# EAGLE design Flight Controller Auxiliary Board (EAGLE 8.6.0)
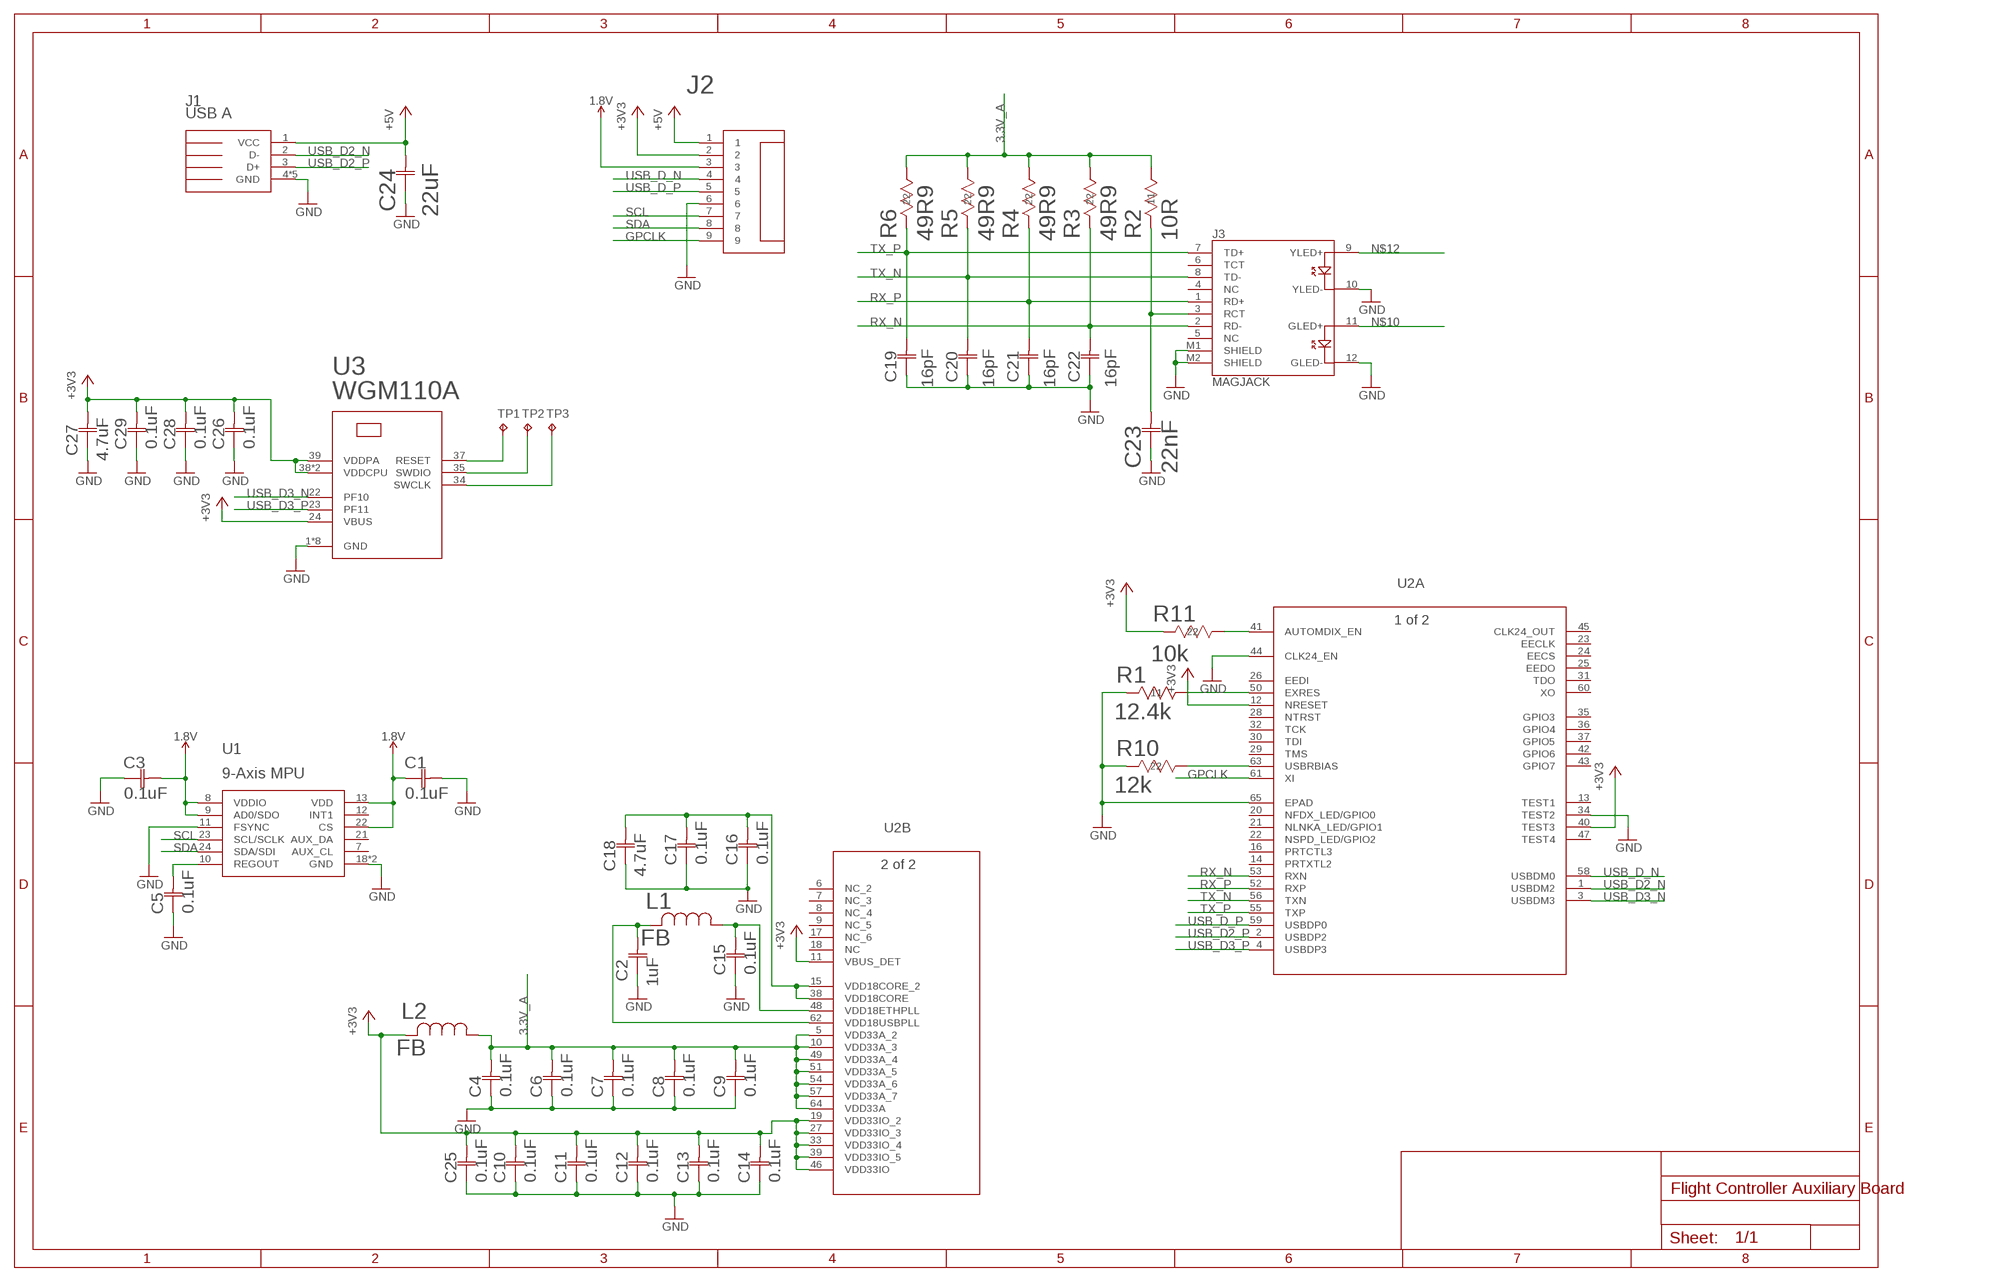
[diagram p0: schematic, sheet 1]

## Parts
C1  0.1uF  0402ZD104KAT2A0402-M  [0402-M]
C2  1uF  CC0805KKX7R7BB105  [YAG_CC0805]
C3  0.1uF  0402ZD104KAT2A0402-M  [0402-M]
C4  0.1uF  0402ZD104KAT2A0402-M  [0402-M]
C5  0.1uF  0402ZD104KAT2A0402-M  [0402-M]
C6  0.1uF  0402ZD104KAT2A0402-M  [0402-M]
C7  0.1uF  0402ZD104KAT2A0402-M  [0402-M]
C8  0.1uF  0402ZD104KAT2A0402-M  [0402-M]
C9  0.1uF  0402ZD104KAT2A0402-M  [0402-M]
C10  0.1uF  0402ZD104KAT2A0402-M  [0402-M]
C11  0.1uF  0402ZD104KAT2A0402-M  [0402-M]
C12  0.1uF  0402ZD104KAT2A0402-M  [0402-M]
C13  0.1uF  0402ZD104KAT2A0402-M  [0402-M]
C14  0.1uF  0402ZD104KAT2A0402-M  [0402-M]
C15  0.1uF  0402ZD104KAT2A0402-M  [0402-M]
C16  0.1uF  0402ZD104KAT2A0402-M  [0402-M]
C17  0.1uF  0402ZD104KAT2A0402-M  [0402-M]
C18  4.7uF  06036D475KAT2A0603-M  [0603-M]
C19  16pF  GRM1555C1H160JA01DG-155-M  [G-155-M]
C20  16pF  GRM1555C1H160JA01DG-155-M  [G-155-M]
C21  16pF  GRM1555C1H160JA01DG-155-M  [G-155-M]
C22  16pF  GRM1555C1H160JA01DG-155-M  [G-155-M]
C23  22nF  GRM155R71H223KA12DG-155-M  [G-155-M]
C24  22uF  GRM21BR60J226ME39L  [G-21]
C25  0.1uF  0402ZD104KAT2A0402-M  [0402-M]
C26  0.1uF  0402ZD104KAT2A0402-M  [0402-M]
C27  4.7uF  06036D475KAT2A0603-M  [0603-M]
C28  0.1uF  0402ZD104KAT2A0402-M  [0402-M]
C29  0.1uF  0402ZD104KAT2A0402-M  [0402-M]
J1  USB_A_VERT  [USB_A_VERTICAL]
J2  9POS_FFC_CONNECTOR  [9POS_FFC_CONNECTOR]
J3  MAGJACK  [MAGJACK]
L1  FB  BLM18AG601SN1DIND_BLM18_0603-M  [IND_BLM18_0603-M]
L2  FB  BLM18AG601SN1DIND_BLM18_0603-M  [IND_BLM18_0603-M]
R1  12.4k  RC0402FR-0712K4LYAG_R0402-M  [YAG_R0402-M]
R2  10R  RNCP0805FTD10R0STA_RNCP0805-M  [STA_RNCP0805-M]
R3  49R9  RC0402FR-0749K9LRC0402N-M  [RC0402N-M]
R4  49R9  RC0402FR-0749K9LRC0402N-M  [RC0402N-M]
R5  49R9  RC0402FR-0749K9LRC0402N-M  [RC0402N-M]
R6  49R9  RC0402FR-0749K9LRC0402N-M  [RC0402N-M]
R10  12k  RC0402FR-0712KLRC0402N-M  [RC0402N-M]
R11  10k  ERA-6AEB103V  [RC0805N]
TP1  TPB2,54  [B2,54]
TP2  TPB2,54  [B2,54]
TP3  TPB2,54  [B2,54]
U1  ICM-20948  [QFN40P300X300X105-25N]
U2  LAN9512-JZXQFN64_9X9MC-M  [QFN64_9X9MC-M]
U3  WGM110A  [WGM110A]

## Nets
1.8V: C1.1 C3.2 J2.3 U1.8(VDDIO) U1.9(AD0/SDO) U1.13(VDD) U1.22(CS)
3.3V_A: C4.2 C6.2 C7.2 C8.2 C9.2 L2.1 R2.2 R3.1 R4.1 R5.1 R6.1 U2.5(B:VDD33A_2) U2.10(B:VDD33A_3) U2.49(B:VDD33A_4) U2.51(B:VDD33A_5) U2.54(B:VDD33A_6) U2.57(B:VDD33A_7) U2.64(B:VDD33A)
+3V3: C10.2 C11.2 C12.2 C13.2 C14.2 C25.2 C26.2 C27.2 C28.2 C29.2 J2.2 L2.2 R11.2 U2.11(B:VBUS_DET) U2.12(A:NRESET) U2.19(B:VDD33IO_2) U2.27(B:VDD33IO_3) U2.33(B:VDD33IO_4) U2.39(B:VDD33IO_5) U2.40(A:TEST3) U2.46(B:VDD33IO) U3.24(VBUS) U3.38(VDDCPU) U3.39(VDDPA) U3.51(VDDCPU)
+5V: C24.2 J1.1(VCC) J2.1
GND: C1.2 C2.1 C3.1 C4.1 C5.1 C6.1 C7.1 C8.1 C9.1 C10.1 C11.1 C12.1 C13.1 C14.1 C15.1 C16.1 C17.1 C18.1 C19.1 C20.1 C21.1 C22.1 C23.1 C24.1 C25.1 C26.1 C27.1 C28.1 C29.1 J1.4(GND) J1.P$5(GND) J1.P$6(GND) J1.P$7(GND) J1.P$8(GND) J2.6 J3.10(YLED-) J3.12(GLED-) J3.M1(SHIELD) J3.M2(SHIELD) R1.1 R10.2 U1.11(FSYNC) U1.18(GND) U1.20(GND) U2.34(A:TEST2) U2.44(A:CLK24_EN) U2.65(A:EPAD) U3.1(GND) U3.16(GND) U3.25(GND) U3.40(GND) U3.42(GND) U3.44(GND) U3.46(GND) U3.48(GND)
GPCLK: J2.9 U2.61(A:XI)
N$1: R11.1 U2.41(A:AUTOMDIX_EN)
N$2: R10.1 U2.63(A:USBRBIAS)
N$3: C15.2 L1.1 U2.48(B:VDD18ETHPLL)
N$4: C2.2 L1.2 U2.62(B:VDD18USBPLL)
N$7: TP1.TP U3.37(RESET)
N$8: TP2.TP U3.35(SWDIO)
N$9: TP3.TP U3.34(SWCLK)
N$10: J3.11(GLED+)
N$11: C5.2 U1.10(REGOUT)
N$12: J3.9(YLED+)
N$14: R1.2 U2.50(A:EXRES)
N$15: C16.2 C17.2 C18.2 U2.15(B:VDD18CORE_2) U2.38(B:VDD18CORE)
N$16: C23.2 J3.3(RCT) R2.1
RX_N: C22.2 J3.2(RD-) R3.2 U2.53(A:RXN)
RX_P: C21.2 J3.1(RD+) R4.2 U2.52(A:RXP)
SCL: J2.7 U1.23(SCL/SCLK)
SDA: J2.8 U1.24(SDA/SDI)
TX_N: C20.2 J3.8(TD-) R5.2 U2.56(A:TXN)
TX_P: C19.2 J3.7(TD+) R6.2 U2.55(A:TXP)
USB_D2_N: J1.2(D-) U2.1(A:USBDM2)
USB_D2_P: J1.3(D+) U2.2(A:USBDP2)
USB_D3_N: U2.3(A:USBDM3) U3.22(PF10)
USB_D3_P: U2.4(A:USBDP3) U3.23(PF11)
USB_D_N: J2.4 U2.58(A:USBDM0)
USB_D_P: J2.5 U2.59(A:USBDP0)
Unconnected: J3.4(NC) J3.5(NC) J3.6(TCT) U1.7(AUX_CL) U1.12(INT1) U1.21(AUX_DA) U2.6(B:NC_2) U2.7(B:NC_3) U2.8(B:NC_4) U2.9(B:NC_5) U2.13(A:TEST1) U2.14(A:PRTXTL2) U2.16(A:PRTCTL3) U2.17(B:NC_6) U2.18(B:NC) U2.20(A:NFDX_LED/GPIO0) U2.21(A:NLNKA_LED/GPIO1) U2.22(A:NSPD_LED/GPIO2) U2.23(A:EECLK) U2.24(A:EECS) U2.25(A:EEDO) U2.26(A:EEDI) U2.28(A:NTRST) U2.29(A:TMS) U2.30(A:TDI) U2.31(A:TDO) U2.32(A:TCK) U2.35(A:GPIO3) U2.36(A:GPIO4) U2.37(A:GPIO5) U2.42(A:GPIO6) U2.43(A:GPIO7) U2.45(A:CLK24_OUT) U2.47(A:TEST4) U2.60(A:XO)

## Library data of the parts
C1 C3-C17 C25 C26 C28 C29 = 0.1uF-capacitor-0402:0402ZD104KAT2A; MANUFACTURER_PART_NUMBER: 0402ZD104KAT2A; VENDOR: AVX Corporation
C2 = 1uF X7R Ceramic Capacitor:CC0805KKX7R7BB105; COPYRIGHT: Copyright C 2015 Accelerated Designs. All rights reserved; MANUFACTURER_PART_NUMBER: CC0805KKX7R7BB105; VENDOR: Vendor
C18 C27 = 4.7uF-capacitor:06036D475KAT2A; MANUFACTURER_PART_NUMBER: 06036D475KAT2A; VENDOR: AVX Corporation
C19-C22 = 16pF-capacitor:GRM1555C1H160JA01D; MANUFACTURER_PART_NUMBER: GRM1555C1H160JA01D; VENDOR: Murata
C23 = 22nF-capacitor:GRM155R71H223KA12D; MANUFACTURER_PART_NUMBER: GRM155R71H223KA12D; VENDOR: Murata
C24 = 22uF X5R Ceramic Capacitor:GRM21BR60J226ME39L; COPYRIGHT: Copyright C 2015 Accelerated Designs. All rights reserved; MANUFACTURER_PART_NUMBER: GRM21BR60J226ME39L; VENDOR: Vendor
J1 = thanics_robotics:USB_A_VERT
J2 = thanics_robotics:9POS_FFC_CONNECTOR
J3 = SparkFun-Connectors:MAGJACK: MAGJACK: RJ-45 with LEDs This is a single port, RJ45 ethernet jacks with built in transformer (magnetics), status LEDs, and shielding. Here is the connector we sell at SparkFun: RJ45 Ethernet MagJack-Compatible <https://www.sparkfun.com/products/8534> (PRT-08534) Datasheet <http://www.sparkfun.com/datasheets/Prototyping/MagJack.pdf> It is used on this SparkFun product: SparkFun RJ45 MagJack Breakout <https://www.sparkfun.com/products/13021> (BOB-13021); PROD_ID: CONN-09556; SF_ID: PRT-08534
L1 L2 = 600ohm-fb:BLM18AG601SN1D; MANUFACTURER_PART_NUMBER: BLM18AG601SN1D; VENDOR: MURATA
R1 = 12.4k-resistor:RC0402FR-0712K4L; MANUFACTURER_PART_NUMBER: RC0402FR0712K4L; VENDOR: Yageo
R2 = 10-resistor:RNCP0805FTD10R0; COPYRIGHT: Copyright C 2015 Accelerated Designs. All rights reserved; MANUFACTURER_PART_NUMBER: RNCP0805FTD10R0; VENDOR: Vendor
R3-R6 = 49.9-resistor:RC0402FR-0749K9L; MANUFACTURER_PART_NUMBER: RC0402FR0749K9L; VENDOR: Yageo
R10 = 12k-resistor:RC0402FR-0712KL; MANUFACTURER_PART_NUMBER: RC0402FR0712KL; VENDOR: Yageo
R11 = 10k-resistor:ERA-6AEB103V; CASE: 0805 2012 metric; COMPOSITION: Thin Film; COPYRIGHT: Copyright C 2015 Accelerated Designs. All rights reserved; DATASHEET: httpindustrial.panasonic.comwwwcgijvcr13pz.cgi?E+PZ+3+AOA0026+ERA6AEB103V+7+WW; DIGIKEYPARTNUMBER: P10KDATRND; HEIGHT: 0.024" 0.60mm; LEADSTYLE: Surface Mount SMD SMT; MANUFACTURER_PART_NUMBER: ERA6AEB103V; NUMBEROFTERMINATIONS: 2; PACKAGECASE: 0805 2012 Metric; PACKAGING: Tape &amp Reel TR; POWERWATTS: 0.125W 18W; QUANTITY_AVAILABLE: 225000; RESISTANCEINOHMS: 10.0K; RESISTANCEOHMS: 10K; SIZEDIMENSION: 0.079" L x 0.049" W 2.00mm x 1.25mm; TEMPERATURECOEFFICIENT: 25ppm°C; TOLERANCE: 0.1%; VENDOR: Panasonic; VOLTAGEWORKING: 100V
TP1-TP3 = testpad:TP: Test pad
U1 = ICM-20948-mpu:ICM-20948
U2 = lan9512:LAN9512-JZX; MANUFACTURER_PART_NUMBER: LAN9512JZX; VENDOR: MICROCHIP
U3 = thanics_robotics:WGM110A

## Board
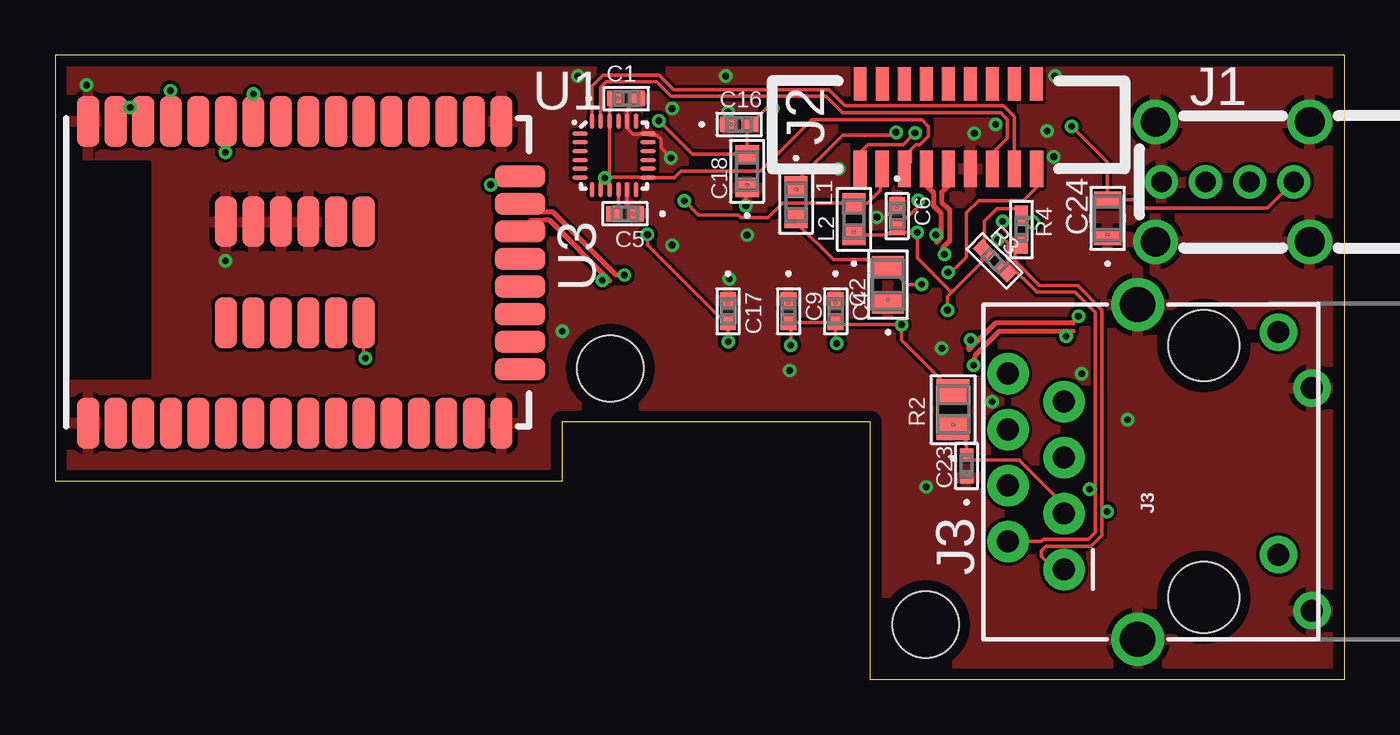
[diagram p1: board, top side]
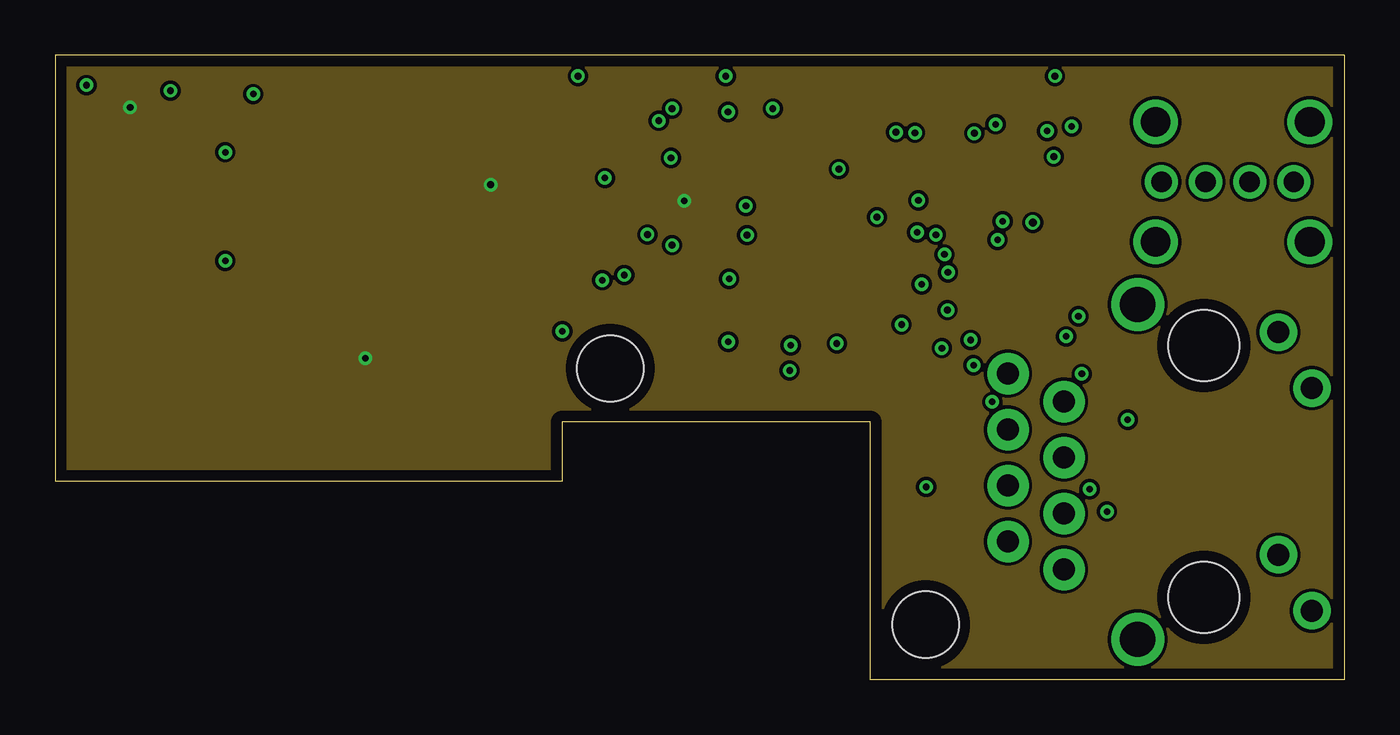
[diagram p2: board, inner layer Route2]
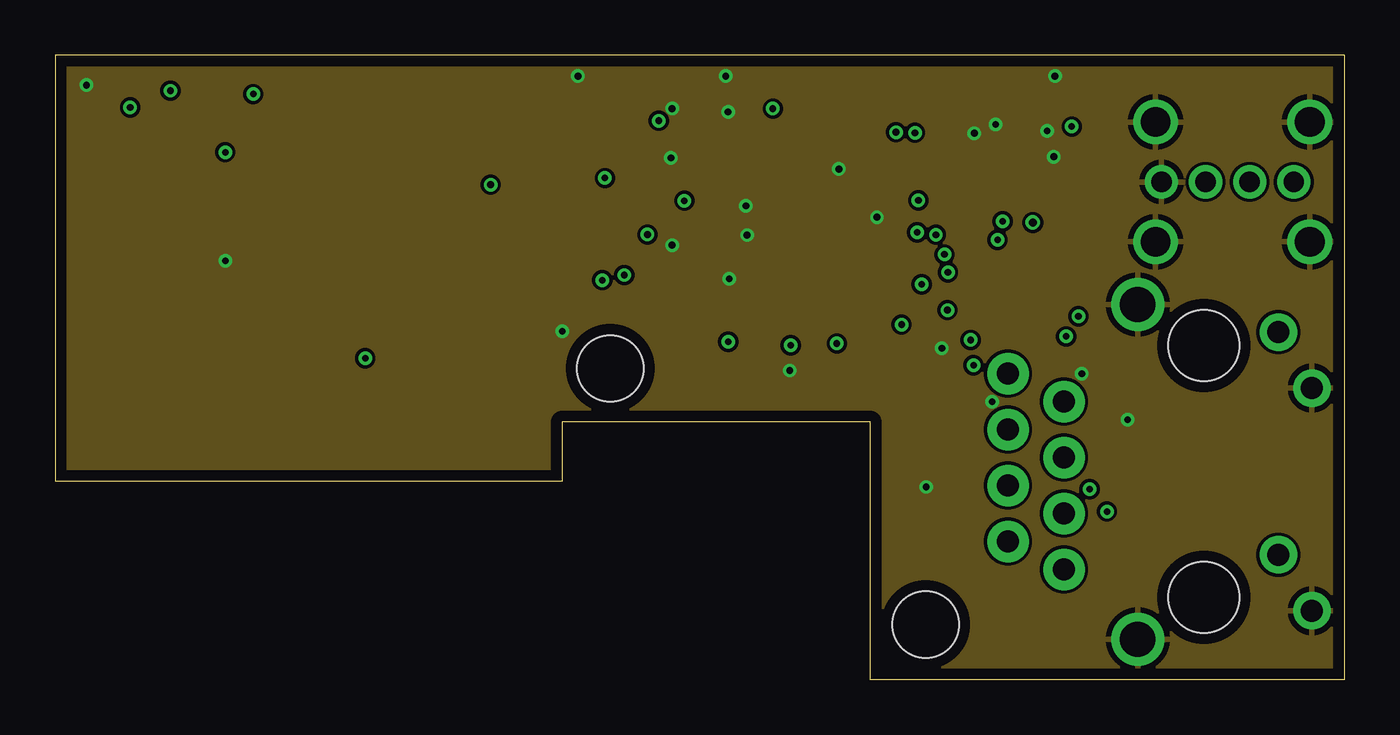
[diagram p3: board, inner layer Route15]
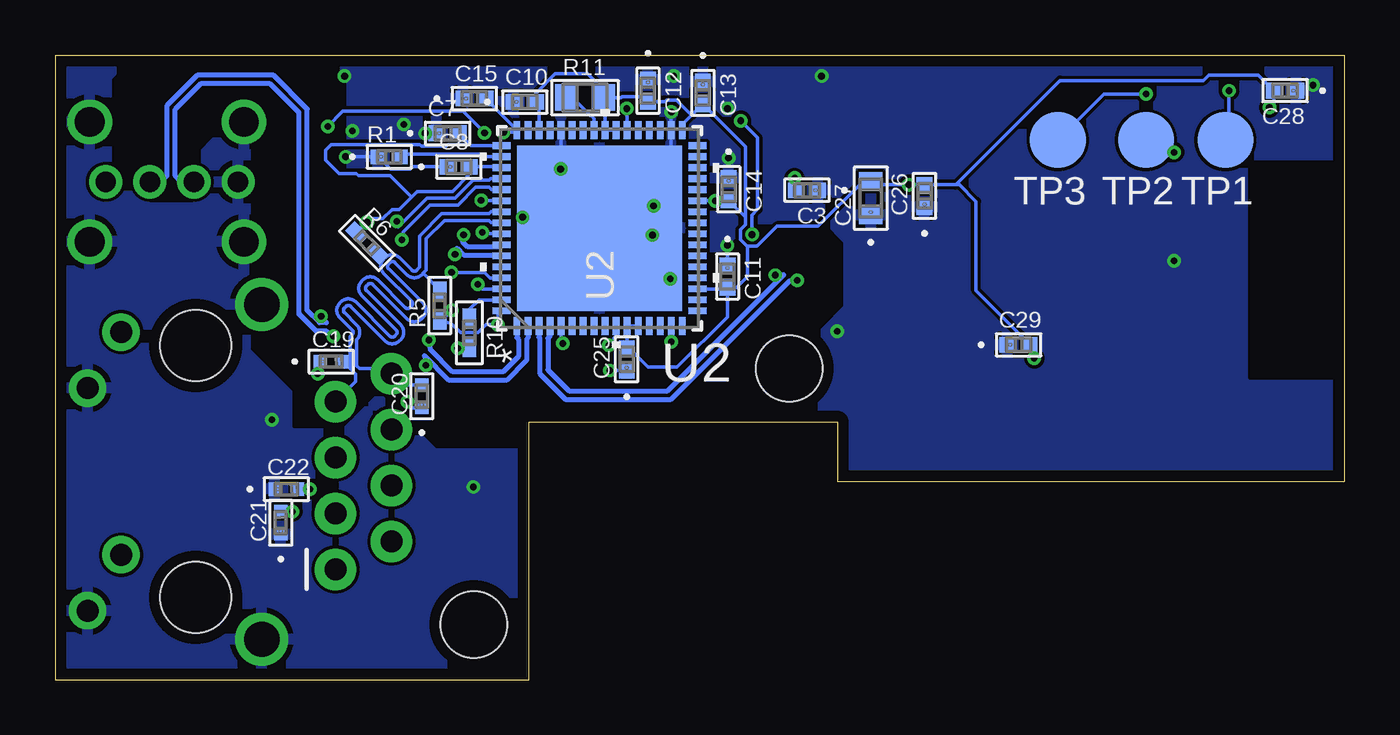
[diagram p4: board, bottom side, seen from below]

Size 58.5 x 28.36 mm. Coordinates in mm from the lower left corner, seen from the top.
Outline: 58.5,28.36 58.5,0 37,0 37,11.7 23,11.7 23,9 0,9 0,28.36 58.5,28.36
Copper layers (1*2*15*16): Top 0.035mm / dielectric 0.2mm / Route2 0.0175mm / dielectric 1.2mm / Route15 0.0175mm / dielectric 0.2mm / Bottom 0.035mm
Design rules "Elecrow_4-layer_PCB_eagle_rule *": minimum track width 6mil, minimum drill 12mil, track to track 6mil, track to pad 6mil, pad to pad 6mil, via to via 8mil, smd to smd 0mil, copper to edge 20mil, drill to drill 10mil, minimum pad ring 6mil, minimum via ring 6mil, stop-mask expansion 0mil, vias tented up to drill 100mil, thermal gap 10mil
Holes 3 mm at 39.5,2.5 25.2,14.13
tRestrict: area -0.1,13.7 to 4.3,23.5
bRestrict: area -0.1,13.7 to 4.3,23.5

### Footprints (pad centres in the part's own frame; a part is rotated, then mirrored left to right if it is on the bottom)
0402-M = smd 0.711 x 0.711: 1 -0.508,0; 2 0.508,0
YAG_CC0805 = smd 0.965 x 1.448: 1 -0.826,0; 2 0.826,0
0603-M = smd 0.813 x 1.067: 1 -0.775,0; 2 0.775,0
G-155-M = smd 0.559 x 0.61: 1 -0.521,0; 2 0.521,0
G-21 = smd 0.711 x 1.245: 1 -0.851,0; 2 0.851,0
USB_A_VERTICAL = drill 0.92 pad 1.5: 1 -3,0; 2 -1,0; 3 1,0; 4 3,0 | drill 1.35 pad 2: P$5 -3.73,-2.72; P$6 -3.73,2.72; P$7 3.27,2.72; P$8 3.27,-2.72
9POS_FFC_CONNECTOR = smd 0.6 x 1.65: 1 -7.27,-2; 2 -6.27,-2; 3 -5.27,-2; 4 -4.27,-2; 5 -3.27,-2; 6 -2.27,-2; 7 -1.27,-2; 8 -0.27,-2; 9 0.73,-2 | smd 0.584 x 1.524: P$16 -7.27,1.852; P$17 -6.27,1.852; P$18 -5.27,1.852; P$19 -4.27,1.852; P$20 -3.27,1.852; P$21 -2.27,1.852; P$22 -1.27,1.852; P$23 -0.27,1.852; P$24 0.73,1.852
MAGJACK = drill 1 pad 1.88: 1 -4.445,6.015; 2 -3.175,8.555; 3 -1.905,6.015; 4 -0.635,8.555; 5 0.635,6.015; 6 1.905,8.555; 7 3.175,6.015; 8 4.445,8.555 | drill 1 pad 1.7: 9 -3.785,-3.715; 10 -6.325,-5.235; 11 6.325,-3.715; 12 3.785,-5.235 | drill 1.6 pad 2.184: M1 -7.62,2.67; M2 7.58,2.67 | hole 3.2: -5.715,-0.335; 5.715,-0.335
IND_BLM18_0603-M = smd 0.914 x 1.041: 1 -0.724,0; 2 0.724,0
YAG_R0402-M = smd 0.66 x 0.66: 1 -0.508,0; 2 0.508,0
STA_RNCP0805-M = smd 1.118 x 1.499: 1 -0.826,0; 2 0.826,0
RC0402N-M = smd 0.864 x 0.61: 1 -0.66,0; 2 0.66,0
RC0805N = smd 1.006 x 1.2: 1 -0.853,0; 2 0.853,0
B2,54 = smd 2.54 x 2.54: TP 0,0
QFN40P300X300X105-25N = smd 0.7 x 0.2: 1 -1.55,1; 2 -1.55,0.6; 3 -1.55,0.2; 4 -1.55,-0.2; 5 -1.55,-0.6; 6 -1.55,-1; 13 1.55,-1; 14 1.55,-0.6; 15 1.55,-0.2; 16 1.55,0.2; 17 1.55,0.6; 18 1.55,1 | smd 0.2 x 0.7: 7 -1,-1.55; 8 -0.6,-1.55; 9 -0.2,-1.55; 10 0.2,-1.55; 11 0.6,-1.55; 12 1,-1.55; 19 1,1.55; 20 0.6,1.55; 21 0.2,1.55; 22 -0.2,1.55; 23 -0.6,1.55; 24 -1,1.55
QFN64_9X9MC-M = smd 0.813 x 0.305: 1 -4.445,3.75; 2 -4.445,3.25; 3 -4.445,2.75; 4 -4.445,2.25; 5 -4.445,1.75; 6 -4.445,1.25; 7 -4.445,0.75; 8 -4.445,0.25; 9 -4.445,-0.25; 10 -4.445,-0.75; 11 -4.445,-1.25; 12 -4.445,-1.75; 13 -4.445,-2.25; 14 -4.445,-2.75; 15 -4.445,-3.25; 16 -4.445,-3.75; 33 4.445,-3.75; 34 4.445,-3.25; 35 4.445,-2.75; 36 4.445,-2.25; 37 4.445,-1.75; 38 4.445,-1.25; 39 4.445,-0.75; 40 4.445,-0.25; 41 4.445,0.25; 42 4.445,0.75; 43 4.445,1.25; 44 4.445,1.75; 45 4.445,2.25; 46 4.445,2.75; 47 4.445,3.25; 48 4.445,3.75 | smd 0.305 x 0.813: 17 -3.75,-4.445; 18 -3.25,-4.445; 19 -2.75,-4.445; 20 -2.25,-4.445; 21 -1.75,-4.445; 22 -1.25,-4.445; 23 -0.75,-4.445; 24 -0.25,-4.445; 25 0.25,-4.445; 26 0.75,-4.445; 27 1.25,-4.445; 28 1.75,-4.445; 29 2.25,-4.445; 30 2.75,-4.445; 31 3.25,-4.445; 32 3.75,-4.445; 49 3.75,4.445; 50 3.25,4.445; 51 2.75,4.445; 52 2.25,4.445; 53 1.75,4.445; 54 1.25,4.445; 55 0.75,4.445; 56 0.25,4.445; 57 -0.25,4.445; 58 -0.75,4.445; 59 -1.25,4.445; 60 -1.75,4.445; 61 -2.25,4.445; 62 -2.75,4.445; 63 -3.25,4.445; 64 -3.75,4.445 | smd 7.493 x 7.493: 65 0,0
WGM110A = smd 2.3 x 1: 1 -6.85,0; 2 -6.85,-1.25; 3 -6.85,-2.5; 4 -6.85,-3.75; 5 -6.85,-5; 6 -6.85,-6.25; 7 -6.85,-7.5; 8 -6.85,-8.75; 9 -6.85,-10; 10 -6.85,-11.25; 11 -6.85,-12.5; 12 -6.85,-13.75; 13 -6.85,-15; 14 -6.85,-16.25; 15 -6.85,-17.5; 16 -6.85,-18.75; 25 6.85,-18.75; 26 6.85,-17.5; 27 6.85,-16.25; 28 6.85,-15; 29 6.85,-13.75; 30 6.85,-12.5; 31 6.85,-11.25; 32 6.85,-10; 33 6.85,-8.75; 34 6.85,-7.5; 35 6.85,-6.25; 36 6.85,-5; 37 6.85,-3.75; 38 6.85,-2.5; 39 6.85,-1.25; 40 6.85,0; 41 -2.3,-6.25; 42 2.3,-6.25; 43 -2.3,-7.5; 44 2.3,-7.5; 45 -2.3,-8.75; 46 2.3,-8.75; 47 -2.3,-10; 48 2.3,-10; 49 -2.3,-11.25; 50 2.3,-11.25; 51 -2.3,-12.5; 52 2.3,-12.5 | smd 1 x 2.3: 17 -4.4,-19.6; 18 -3.15,-19.6; 19 -1.9,-19.6; 20 -0.65,-19.6; 21 0.6,-19.6; 22 1.85,-19.6; 23 3.1,-19.6; 24 4.35,-19.6

### Placement (x,y rotation side)
C1  25.91,26.38 0 top
C2  37.79,17.93 90 top
C3  24.39,22.22 180 bottom
C4  35.41,16.73 270 top
C5  25.86,21.15 180 top
C6  38.2,21.05 270 top
C7  40.69,24.81 0 bottom
C8  40.19,23.28 0 bottom
C9  33.28,16.73 270 top
C10  37.19,26.23 0 bottom
C11  27.99,18.31 270 bottom
C12  31.6,26.74 270 bottom
C13  29.11,26.64 270 bottom
C14  27.94,22.27 270 bottom
C15  39.47,26.38 0 bottom
C16  31.04,25.21 0 top
C17  30.53,16.73 270 top
C18  31.4,23.08 90 top
C19  45.98,14.44 0 bottom
C20  41.86,12.87 90 bottom
C21  48.26,7.13 90 bottom
C22  48.01,8.65 0 bottom
C23  41.35,9.71 90 top
C24  47.75,20.95 90 top
C25  32.57,14.55 90 bottom
C26  19.05,21.96 90 bottom
C27  21.49,21.86 90 bottom
C28  2.69,26.74 180 bottom
C29  14.79,15.21 0 bottom
J1  53.2,22.6 180 top
J2  43.8,25.19 0 top
J3  51.79,9.46 90 top
L1  33.62,21.67 270 top
L2  36.25,20.9 90 top
R1  43.33,23.74 0 bottom
R2  40.74,12.26 90 top
R3  42.62,19.02 315 top
R4  43.84,20.44 270 top
R5  41.05,16.98 90 bottom
R6  44.35,19.83 315 bottom
R10  39.71,15.75 270 bottom
R11  34.45,26.42 0 bottom
TP1  5.4,24.5 180 bottom
TP2  9,24.5 180 bottom
TP3  13,24.5 180 bottom
U1  25.36,23.8 0 top
U2  33.79,20.49 90 bottom
U3  1.5,18.5 90 top

### Tracks (layer width: path | path; a pad name or v marks a point on that pad's centre or on a via)
1.8V  (via drill 0.3)
  Top 0.152: v24.95,22.78 24.76,22.59 U1.8 | U1.9 25.16,22.56 v24.95,22.78 | 25.15,22.83 26.49,22.83 26.52,22.8 U1.13 28.12,22.8 28.4,23.08 32.01,23.08 34.34,25.42 39.32,25.42 39.63,25.11 39.63,24.68 39.24,24.3 39.06,24.3 38.81,24.05 38.81,23.47 J2.3 | 25.15,22.83 24.99,22.83 v24.95,22.78 | C1.1 25.4,26.18 25.15,25.93 25.15,25.36 U1.22 25.16,22.84 25.15,22.83
  Bottom 0.152: C3.2 24.95,22.27 v24.95,22.78
3.3V_A  (via drill 0.3, 0.35)
  Top 0.152: C6.2 38.2,20.64 37.74,20.18 L2.1 | C6.2 38.48,20.31 v39.12,20.31 39.12,19.13 40.61,17.65 40.74,17.65 | C4.2 35.51,16.12 v38.41,16.12 38.41,15.42 R2.2 | C4.2 C9.2 33.38,16.12 v33.38,15.19 | C6.2 38.64,20.97 38.65,20.97 39.17,21.49 v39.17,21.76 | v40.49,16.78 40.49,17.39 40.74,17.65 | 40.74,17.65 42.06,18.96 42.06,19.48 R3.1 42.16,20.81 42.73,21.38 43.56,21.38 R4.1 44.02,21.1 v44.36,20.75 | C4.2 35.41,15.33 v35.47,15.27
  Bottom 0.152: U2.51 38.28,23.28 C8.2 39.75,23.21 39.75,22.89 40.47,22.17 42.07,22.17 42.33,21.91 | U2.54 39.15,21.74 v39.17,21.76 | U2.57 39.05,20.24 v39.12,20.31 | U2.64 38.41,16.58 v38.41,16.12 38.94,16.12 39.31,15.76 40.1,15.76 40.52,16.17 R5.1 40.95,16.32 v40.49,16.78 | 42.33,21.91 42.89,21.34 43.22,21.34 43.63,20.93 44.19,20.93 v44.36,20.75 R6.1 | v33.38,15.19 33.15,15.41 33.15,15.51 33.05,15.61 U2.10 | U2.49 39.62,24.24 39.68,24.3 | 39.68,24.3 C7.2 | 39.68,24.3 40.67,24.3 40.75,24.22 41.88,24.22 41.96,24.3 45.98,24.3 46.23,24.05 46.23,23.59 45.62,22.98 44.83,22.98 44.73,22.88 43.3,22.88 42.33,21.91 | U2.5 35.55,15.34 v35.47,15.27
+3V3  (via drill 0.3)
  Top 0.152: J2.2 37.44,23.1 37.44,22.22 36.85,21.63 L2.2 34.24,21.63 34.23,21.63 33.01,21.63 32.34,20.97 31.12,20.97 31.01,21.09 29.2,21.09 v28.55,21.74 | U3.24 20.72,22.47 v19.76,22.47 | U3.51 14,14.67 v14.07,14.6 | U3.39 3.38,25.98 v3.41,25.98 3.41,25.94 U3.38
  Bottom 0.152: U2.19 28.05,17.74 C11.2 | U2.33 30.05,25.2 29.59,25.65 | 29.59,25.65 C13.2 27.18,24.2 27.18,21 | U2.39 U2.40 33.55,26.37 R11.2 33.53,26.42 | 29.59,25.65 29.65,25.65 30.31,26.31 30.75,26.31 30.83,26.23 C12.2 31.83,26.46 32.79,26.46 32.82,26.42 33.53,26.42 | U2.27 v28.55,21.74 27.96,21.74 C14.2 27.18,21 | C11.2 27.59,17.8 27.08,18.31 27.08,19.68 | C11.2 27.99,16.48 30.28,14.19 31.59,14.19 32.56,15.16 C25.2 32.51,16.02 U2.11 U2.12 | U2.46 36.55,26.09 C10.2 36.68,26.64 35.82,27.5 34.34,27.5 33.78,26.94 33.78,26.68 33.53,26.42 | v14.07,14.6 14.07,15 C29.2 14.71,15.64 14.71,15.66 16.72,17.66 16.72,21.71 17.48,22.47 17.63,22.47 | v3.41,25.98 3.2,26.18 C28.2 3.91,27.45 6.15,27.45 6.4,27.2 12.91,27.2 17.63,22.47 | 17.63,22.47 C26.2 v19.76,22.47 21.33,22.47 C27.2 21.83,22.64 23.88,20.59 25.74,20.59 26.66,19.68 27.08,19.68 | 27.18,21 27.18,20.66 27.41,20.43 27.41,19.99 27.1,19.68 27.08,19.68
  pour Route2: 0.05,28.26 58.57,28.26 58.57,0.07 0.05,0.07
+5V  (via drill 0.3)
  Top 0.152: J2.1 36.53,23.94 36.88,24.3 | 36.88,24.3 | 36.88,24.3 38.48,24.3 v39.02,24.83 | v46.13,25.11 47.75,23.49 C24.2 48.99,21.8 49.38,21.4 55,21.4 J1.1
  Bottom 0.152: v39.02,24.83 39.99,25.8 45.44,25.8 v46.13,25.11
GND  (via drill 0.3)
  Top 0.152: C6.1 37.77,21.12 37.75,21.12 37.63,21 v37.29,21 | U1.11 25.96,21.56 C5.1 | C1.2 25.99,25.95 25.99,25.93 25.96,25.91 U1.20 25.96,25.03 26.22,24.77 26.49,24.77 26.52,24.8 U1.18 26.98,24.73 27.3,24.73 27.49,24.53 27.49,24.15 v27.94,23.69 | C18.1 31.35,22.26 v31.35,21.51
  Bottom 0.152: U2.65 35.55,22.24 U2.44 | U2.65 30.55,23.74 U2.34 30.55,25.76 v30.53,25.77 | U2.65 32.36,20.49 v31.35,21.51 | C7.1 v41.71,24.81 | v40.24,15.05 40.2,15.09 R10.2 | v42.52,12.62 42.26,12.35 C20.1 | C19.1 46.5,13.89 v46.59,13.89 | C11.1 v27.99,19.73 | C25.1 v33.33,14.04 | C8.1 42.3,23.28 42.4,23.18 43.28,23.18 R1.1 v45.32,23.74
  other vias: 30.43,27.4 23.73,27.4 45.01,24.91 1.42,26.99 7.72,19.02 30.58,18.2 27.99,25.93 31.4,20.19 42.67,25.21 45.37,27.4 39.52,8.76 48.67,11.8 23.01,15.82 35.56,23.18
  pour Top: -2.5,28.36 58.5,28.36 58.5,0 -2.5,0
  pour Bottom (rank 2): -2.5,28.36 58.5,28.36 58.5,0 -2.5,0
  pour Route15: 0.05,28.31 0.05,0.02 58.57,0.02 58.57,28.31
GPCLK  (via drill 0.3)
  Top 0.152: 41.35,20.15 | 41.35,20.15 41.35,21.2 41.91,21.76 43.94,21.76 44.53,22.35 J2.9 | 41.35,20.15 41.35,19.2 40.65,18.49 v40.51,18.49
  Bottom 0.152: U2.61 38.76,18.24 39,18.48 40.02,18.48 40.03,18.49 v40.51,18.49
N$1
  Bottom 0.152: R11.1 35.03,26.42 34.2,25.59 34.16,25.59 34.04,25.47 U2.41
N$2
  Bottom 0.152: U2.63 39.27,17.24 39.7,16.8 R10.1
N$3  (via drill 0.3)
  Top 0.152: L1.1 33.62,22.61 35.74,24.73 38.03,24.73 v38.15,24.85
  Bottom 0.152: C15.2 38.43,25.82 U2.48 37.63,24.85 v38.15,24.85
N$4  (via drill 0.3)
  Top 0.152: v39.32,17.95 38.66,17.95 C2.2 37.48,19.07 35.31,19.07 33.62,20.76 L1.2
  Bottom 0.152: U2.62 39.12,17.74 v39.32,17.95
N$5
  cutout Bottom: 34.65,16.02 31.55,16.02 28.04,19.52 26.98,20.59 25.81,20.59 23.57,20.59 22.81,19.83 22.81,16.98 23.62,16.17 29.21,10.58 36.32,10.58 41.2,10.58 43.79,13.17 45.47,11.5 47.65,11.5 47.65,13.12 49.53,15 49.53,24.66 49.74,24.86 51.21,24.86 51.46,24.6 51.97,24.1 51.97,22.06 52.28,21.76 54.16,21.76 55.83,23.44 55.83,25.77 55.83,27.25 54,29.08 47.3,29.08 45.52,27.3 45.37,27.14 45.37,21.25 42.47,24.15 37.59,24.15 34.65,21.2
N$7  (via drill 0.3)
  Top 0.152: U3.37 5.25,26.72 v5.23,26.74
  Bottom 0.152: v5.23,26.74 5.23,24.66 TP1.TP
N$8  (via drill 0.3)
  Top 0.152: v7.72,23.94 7.72,25.32 U3.35
  Bottom 0.152: TP2.TP 8.28,24.5 v7.72,23.94
N$9  (via drill 0.3)
  Top 0.152: v8.99,26.59 v9,26.58 U3.34
  Bottom 0.152: TP3.TP 10.91,26.59 v8.99,26.59
N$11
  Top 0.152: U1.10 25.56,21.36 C5.2
N$14
  Bottom 0.152: U2.50 39.1,23.74 39.23,23.87 42.7,23.87 R1.2
N$15  (via drill 0.3)
  Top 0.152: v32.56,25.93 32.26,25.93 C16.2 31.4,25.06 C18.2 28.91,23.85 v27.39,25.38 | 30.53,16.07 C17.2 | 30.53,16.07 30.53,15.36 v30.55,15.34 | v26.88,20.21 26.88,19.73 30.53,16.07
  Bottom 0.152: U2.38 32.55,25.91 v32.56,25.93 | v30.55,15.34 U2.15 | v27.39,25.38 26.62,24.6 26.62,21.35 26.88,21.1 v26.88,20.21
N$16
  Top 0.152: R2.1 41.35,10.83 C23.2 41.59,9.99 43.72,9.99 45.78,7.93 J3.3
RX_N  (via drill 0.3)
  Top 0.152: v42.76,19.97 42.72,20.33 43.23,19.82 43.23,18.9 | 47.2,8.65 47.2,16.67 46.27,17.59 44.54,17.59 43.23,18.9 | 47.2,8.65 47.2,6.69 46.88,6.37 45.06,6.37 44.96,6.37 44.83,6.37 44.75,6.28 J3.2 | v46.94,8.65 47.2,8.65 | R3.2 43.09,18.76 43.23,18.9
  Bottom 0.152: U2.53 38.69,22.24 38.81,22.37 39.41,22.37 40.22,21.56 41.49,21.56 42.72,20.33 v42.76,19.97 | C22.2 v46.94,8.65
RX_P  (via drill 0.3)
  Top 0.152: v42.99,20.81 42.94,20.55 43.54,19.94 | 43.54,19.94 43.54,19.03 44.67,17.9 46.4,17.9 47.5,16.79 47.5,7.64 | 47.5,7.64 47.5,6.56 47.01,6.06 44.96,6.06 44.76,5.86 44.76,5.61 45.35,5.01 J3.1 | v47.73,7.64 47.5,7.64 | R4.2 43.7,19.78 43.54,19.94
  Bottom 0.152: U2.52 38.74,22.74 38.81,22.67 39.54,22.67 40.35,21.86 41.62,21.86 42.94,20.55 v42.99,20.81 | C21.2 47.74,7.65 v47.73,7.64
SCL
  Top 0.152: U1.23 24.74,25.36 24.74,26.89 25,27.15 27.28,27.15 27.94,26.48 34.98,26.48 35.72,25.75 42.9,25.75 43.08,25.57 43.08,25.56 43.21,25.44 43.21,24.59 42.53,23.91 J2.7
SDA
  Top 0.152: U1.24 24.36,26.94 24.87,27.45 27.41,27.45 28.07,26.79 35.11,26.79 35.85,26.05 43.03,26.05 43.53,25.55 J2.8
TX_N
  Bottom 0.152: U2.56 38.71,20.74 38.81,20.85 40.83,20.85 41.66,20.02 41.66,18.6 41.8,18.45 | 41.8,18.45 41.88,18.38 arc90 42.52,18.38 43.09,18.95 arc-90 43.3,18.95 43.37,18.88 arc-90 43.37,18.66 41.81,17.1 arc90 41.81,16.45 41.88,16.38 arc90 42.53,16.38 44.09,17.95 arc-90 44.3,17.95 44.37,17.88 arc-90 44.37,17.66 42.81,16.1 arc90 42.81,15.45 42.88,15.38 arc90 43.53,15.38 45.09,16.95 arc-90 45.3,16.95 45.37,16.88 arc-90 45.37,16.66 44.81,16.09 arc90 44.81,15.45 44.81,14.25 44.67,14.12 43.45,14.12 J3.8 42.73,13.39 C20.2 | R5.2 41.05,17.7 41.8,18.45
TX_P
  Bottom 0.152: U2.55 38.72,21.24 38.81,21.15 40.96,21.15 41.96,20.15 41.96,18.72 42.09,18.59 arc90 42.31,18.59 42.87,19.16 arc-90 43.52,19.16 43.59,19.09 | J3.7 44.87,13.54 44.87,13.88 45.11,14.13 45.11,14.5 | 43.59,19.09 arc-90 43.59,18.45 42.33,17.18 arc90 42.33,16.97 42.4,16.9 arc90 42.61,16.9 43.87,18.16 arc-90 44.52,18.16 44.59,18.09 arc-90 44.59,17.45 43.03,15.88 arc90 43.03,15.67 43.1,15.6 arc90 43.31,15.6 44.87,17.16 arc-90 45.52,17.16 45.59,17.09 arc-90 45.59,16.45 45.02,15.88 arc90 45.02,15.66 45.11,15.58 45.11,14.5 | C19.2 45.11,14.5 | 43.59,19.09 43.61,19.09 R6.2
USB_D2_N  (via drill 0.3)
  Top 0.229: v41.54,15.42 41.47,14.99 42.7,16.21 46.18,16.21 v46.43,16.5
  Bottom 0.229: U2.1 37.55,15.53 37.48,15.46 37.48,14.68 38.18,13.98 40.46,13.98 41.47,14.99 v41.54,15.42 | v46.43,16.5 46.18,16.21 46.51,16.21 47.06,16.76 47.06,25.9 48.59,27.44 52.05,27.44 53.43,26.05 53.43,22.88 53.71,22.6 J1.2
USB_D2_P  (via drill 0.3)
  Top 0.229: v41.67,14.28 41.74,14.72 42.85,15.83 46.18,15.83 v45.88,15.59
  Bottom 0.229: U2.2 37.05,15.52 37.1,15.46 37.1,14.52 38.02,13.59 40.62,13.59 41.74,14.72 v41.67,14.28 | v45.88,15.59 46.18,15.83 46.66,15.83 47.44,16.6 47.44,25.74 48.75,27.06 51.89,27.06 53.05,25.9 53.05,22.88 52.77,22.6 J1.3
USB_D3_N  (via drill 0.3)
  Top 0.229: v24.83,18.14 25.17,18.12 22.43,20.86 22.18,20.86 22.16,20.83 21.58,20.83 U3.22
  Bottom 0.229: U2.3 36.55,15.54 36.52,15.51 36.52,13.91 35.34,12.73 30.56,12.73 25.17,18.12 v24.83,18.14
USB_D3_P  (via drill 0.3)
  Top 0.229: v25.82,18.37 25.44,18.39 22.59,21.24 21.46,21.24 U3.23
  Bottom 0.229: U2.4 36.05,15.6 36.13,15.51 36.13,14.07 35.18,13.11 30.71,13.11 25.44,18.39 v25.82,18.37
USB_D_N  (via drill 0.3)
  Top 0.229: J2.4 39.53,22.43 39.84,22.12 39.84,21.53 40.2,21.17 40.2,20.06 40,19.86 v39.97,20.2
  Bottom 0.229: v39.97,20.2 40,19.86 39.8,19.66 38.32,19.66 U2.58
USB_D_P  (via drill 0.3)
  Top 0.229: J2.5 40.53,22.42 40.22,22.12 40.22,21.69 40.58,21.33 40.58,19.9 40.27,19.59 v40.35,19.31
  Bottom 0.229: v40.35,19.31 40.27,19.59 39.96,19.28 38.28,19.28 U2.59

### Text on the board
tPlace: U1 | J2 | J1 | U3 | J3
bPlace: U2